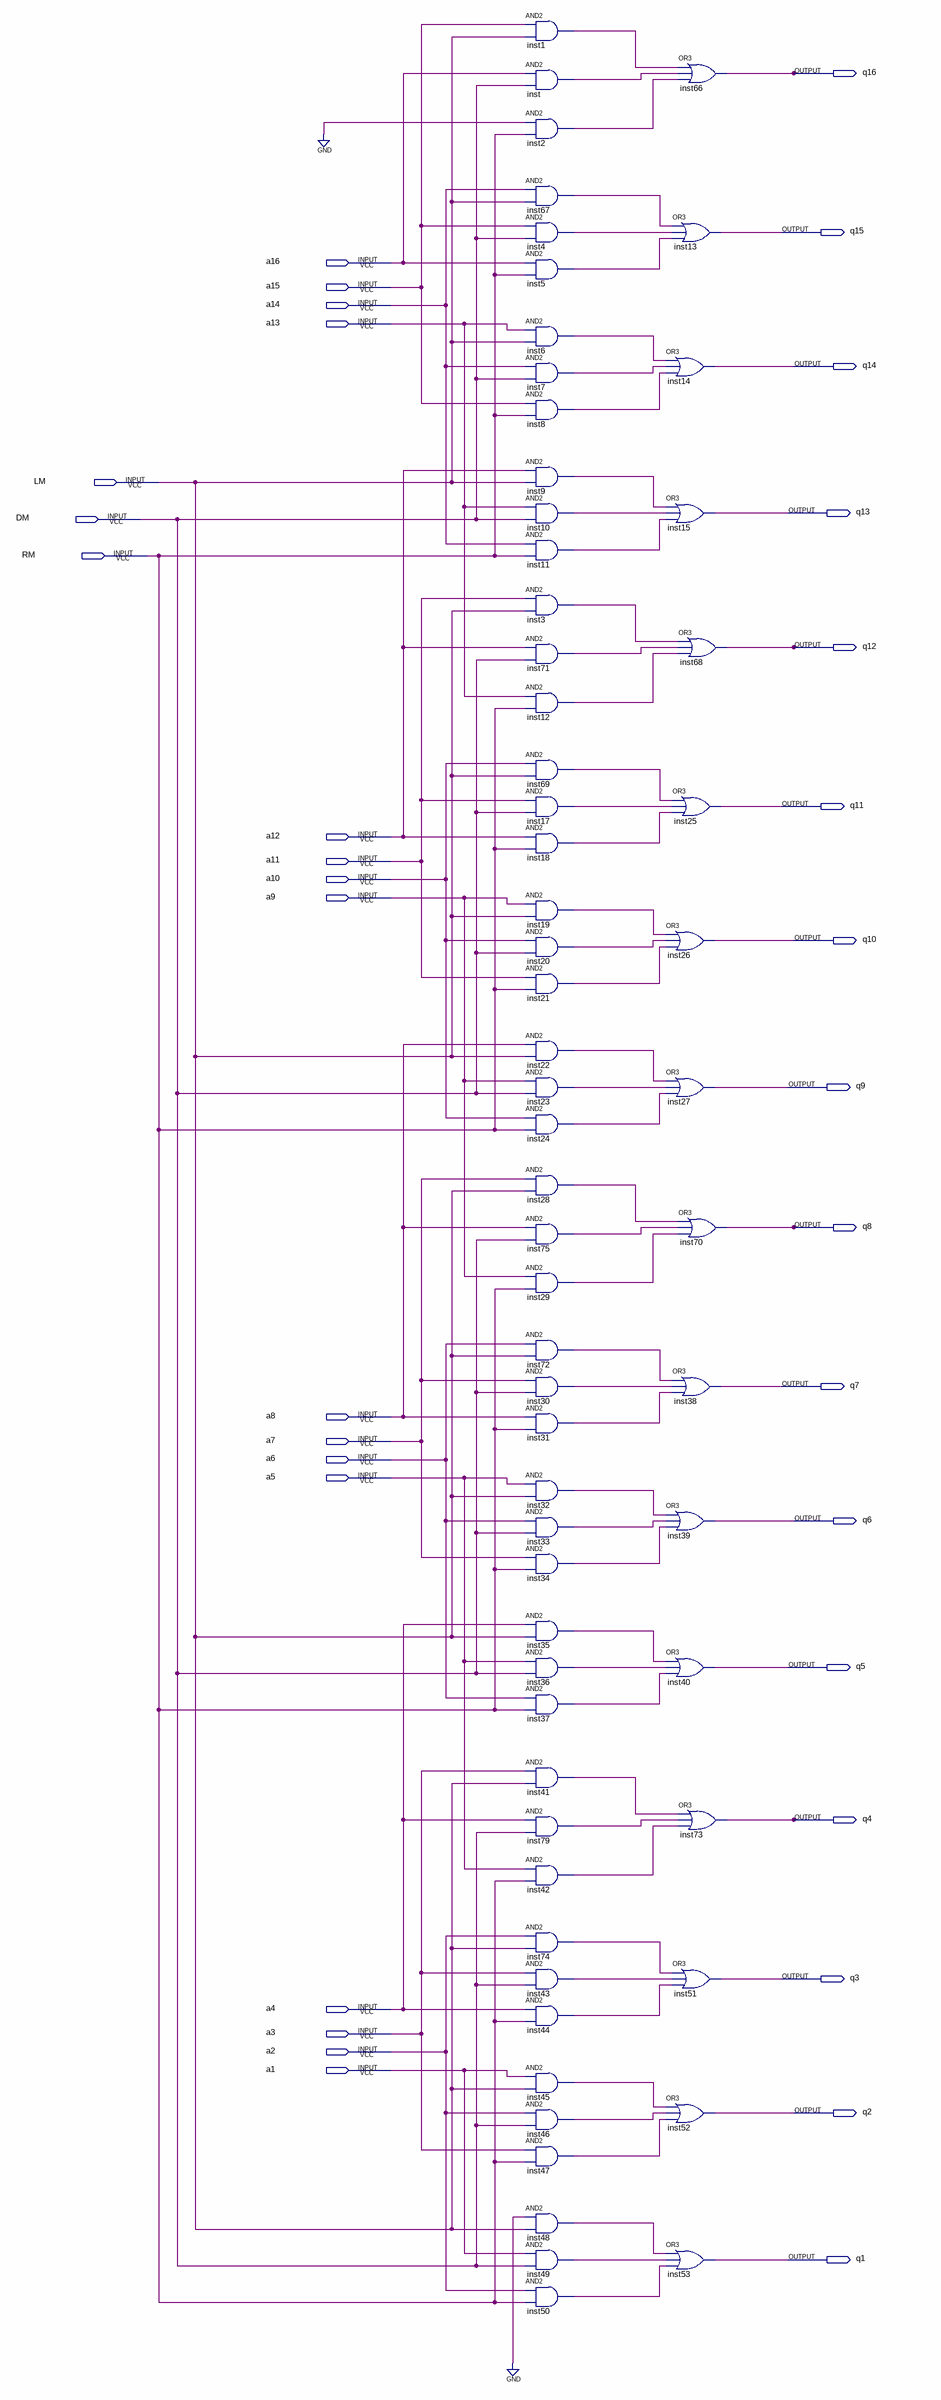
[diagram p0: schematic sheet]
// Quartus schematic shifter16.bdf as structural Verilog: 64 symbols, 35 pins
module shifter16 (
  input  a16,
  input  a15,
  input  a14,
  input  a13,
  input  LM,
  input  DM,
  input  RM,
  input  a12,
  input  a11,
  input  a10,
  input  a9,
  input  a8,
  input  a7,
  input  a6,
  input  a5,
  input  a4,
  input  a3,
  input  a2,
  input  a1,
  output q16,
  output q15,
  output q14,
  output q13,
  output q12,
  output q11,
  output q10,
  output q9,
  output q8,
  output q7,
  output q6,
  output q5,
  output q4,
  output q3,
  output q2,
  output q1
);

  wire inst1_out, inst2_out, inst3_out, inst4_out, inst5_out, inst6_out, inst7_out, inst8_out, inst9_out,
       inst10_out, inst11_out, inst12_out, inst17_out, inst18_out, inst19_out, inst20_out, inst21_out,
       inst22_out, inst23_out, inst24_out, inst28_out, inst29_out, inst30_out, inst31_out, inst32_out,
       inst33_out, inst34_out, inst35_out, inst36_out, inst37_out, inst41_out, inst42_out, inst43_out,
       inst44_out, inst45_out, inst46_out, inst47_out, inst48_out, inst49_out, inst50_out, inst67_out,
       inst69_out, inst71_out, inst72_out, inst74_out, inst75_out, inst79_out, inst_out;

  and inst1 (inst1_out, a15, LM);
  and inst (inst_out, a16, DM);
  and inst2 (inst2_out, 1'b0, RM);
  and inst67 (inst67_out, a14, LM);
  and inst4 (inst4_out, a15, DM);
  and inst5 (inst5_out, a16, RM);
  and inst6 (inst6_out, a13, LM);
  and inst7 (inst7_out, a14, DM);
  and inst8 (inst8_out, a15, RM);
  and inst9 (inst9_out, a12, LM);
  and inst10 (inst10_out, a13, DM);
  and inst11 (inst11_out, a14, RM);
  and inst3 (inst3_out, a11, LM);
  and inst71 (inst71_out, a12, DM);
  and inst12 (inst12_out, a13, RM);
  and inst69 (inst69_out, a10, LM);
  and inst17 (inst17_out, a11, DM);
  and inst18 (inst18_out, a12, RM);
  and inst19 (inst19_out, a9, LM);
  and inst20 (inst20_out, a10, DM);
  and inst21 (inst21_out, a11, RM);
  and inst22 (inst22_out, a8, LM);
  and inst23 (inst23_out, a9, DM);
  and inst24 (inst24_out, a10, RM);
  and inst28 (inst28_out, a7, LM);
  and inst75 (inst75_out, a8, DM);
  and inst29 (inst29_out, a9, RM);
  and inst72 (inst72_out, a6, LM);
  and inst30 (inst30_out, a7, DM);
  and inst31 (inst31_out, a8, RM);
  and inst32 (inst32_out, a5, LM);
  and inst33 (inst33_out, a6, DM);
  and inst34 (inst34_out, a7, RM);
  and inst35 (inst35_out, a4, LM);
  and inst36 (inst36_out, a5, DM);
  and inst37 (inst37_out, a6, RM);
  and inst41 (inst41_out, a3, LM);
  and inst79 (inst79_out, a4, DM);
  and inst42 (inst42_out, a5, RM);
  and inst74 (inst74_out, a2, LM);
  and inst43 (inst43_out, a3, DM);
  and inst44 (inst44_out, a4, RM);
  and inst45 (inst45_out, a1, LM);
  and inst46 (inst46_out, a2, DM);
  and inst47 (inst47_out, a3, RM);
  and inst48 (inst48_out, 1'b0, LM);
  and inst49 (inst49_out, a1, DM);
  and inst50 (inst50_out, a2, RM);
  or inst66 (q16, inst1_out, inst_out, inst2_out);
  or inst13 (q15, inst67_out, inst4_out, inst5_out);
  or inst14 (q14, inst6_out, inst7_out, inst8_out);
  or inst15 (q13, inst9_out, inst10_out, inst11_out);
  or inst68 (q12, inst3_out, inst71_out, inst12_out);
  or inst25 (q11, inst69_out, inst17_out, inst18_out);
  or inst26 (q10, inst19_out, inst20_out, inst21_out);
  or inst27 (q9, inst22_out, inst23_out, inst24_out);
  or inst70 (q8, inst28_out, inst75_out, inst29_out);
  or inst38 (q7, inst72_out, inst30_out, inst31_out);
  or inst39 (q6, inst32_out, inst33_out, inst34_out);
  or inst40 (q5, inst35_out, inst36_out, inst37_out);
  or inst73 (q4, inst41_out, inst79_out, inst42_out);
  or inst51 (q3, inst74_out, inst43_out, inst44_out);
  or inst52 (q2, inst45_out, inst46_out, inst47_out);
  or inst53 (q1, inst48_out, inst49_out, inst50_out);
endmodule
